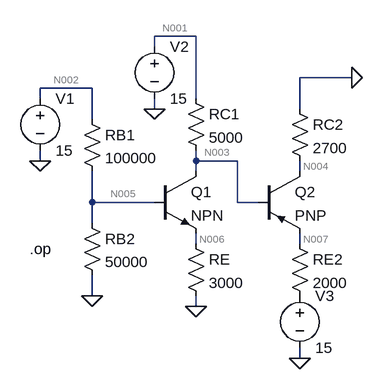
[diagram p0: schematic ECDL_ASSIGNMNEN4_APNANAAM.asc]
ECDL_ASSIGNMNEN4_APNANAAM.asc, the LTspice schematic file:
Version 4
SHEET 1 880 680
WIRE 192 -80 128 -80
WIRE 128 -64 128 -80
WIRE 432 -16 352 -16
WIRE 32 0 -48 0
WIRE -48 16 -48 0
WIRE 192 16 192 -80
WIRE 128 32 128 16
WIRE 352 32 352 -16
WIRE 32 48 32 0
WIRE -48 112 -48 96
WIRE 192 112 192 96
WIRE 256 112 192 112
WIRE 192 128 192 112
WIRE 352 128 352 112
WIRE 32 176 32 128
WIRE 128 176 32 176
WIRE 256 176 256 112
WIRE 288 176 256 176
WIRE 32 208 32 176
WIRE 192 240 192 224
WIRE 352 240 352 224
WIRE 32 320 32 288
WIRE 192 336 192 320
WIRE 352 416 352 400
FLAG 32 320 0
FLAG 192 336 0
FLAG 432 -16 0
FLAG -48 112 0
FLAG 128 32 0
FLAG 352 416 0
SYMBOL res 16 32 R0
SYMATTR InstName RB1
SYMATTR Value 100000
SYMBOL res 16 192 R0
SYMATTR InstName RB2
SYMATTR Value 50000
SYMBOL res 176 0 R0
SYMATTR InstName RC1
SYMATTR Value 5000
SYMBOL res 176 224 R0
SYMATTR InstName RE
SYMATTR Value 3000
SYMBOL res 336 224 R0
SYMATTR InstName RE2
SYMATTR Value 2000
SYMBOL npn 128 128 R0
SYMATTR InstName Q1
SYMBOL pnp 288 128 R0
SYMATTR InstName Q2
SYMBOL res 336 16 R0
SYMATTR InstName RC2
SYMATTR Value 2700
SYMBOL voltage -48 0 R0
SYMATTR InstName V1
SYMATTR Value 15
SYMBOL voltage 128 -80 R0
SYMATTR InstName V2
SYMATTR Value 15
SYMBOL voltage 352 304 R0
SYMATTR InstName V3
SYMATTR Value 15
TEXT -64 248 Left 2 !.op

The netlist it stands for:
* ECDL_ASSIGNMNEN4_APNANAAM.asc
RB1 N002 N005 100000
RB2 N005 0 50000
RC1 N001 N003 5000
RE N006 0 3000
RE2 N007 P001 2000
Q1 N003 N005 N006 0 NPN
Q2 N004 N003 N007 0 PNP
RC2 0 N004 2700
V1 N002 0 15
V2 N001 0 15
V3 P001 0 15
.model NPN NPN
.model PNP PNP
.lib standard.bjt
.op
.backanno
.end

* Results of the author's LTspice run, read from the files saved beside the schematic
* Operating Point:
*   V(n002) = 15 V
*   V(n005) = 4.582 V
*   V(n001) = 15 V
*   V(n003) = 8.859 V
*   V(n006) = 3.802 V
*   V(n007) = 9.658 V
*   V(p001) = 15 V
*   V(n004) = 7.14 V
*   Ic(Q2) = -2.644 mA
*   Ib(Q2) = -26.44 µA
*   Ie(Q2) = 2.671 mA
*   Ic(Q1) = 1.255 mA
*   Ib(Q1) = 12.55 µA
*   Ie(Q1) = -1.267 mA
*   I(Rc2) = -2.644 mA
*   I(Re2) = -2.671 mA
*   I(Re) = 1.267 mA
*   I(Rc1) = 1.228 mA
*   I(Rb2) = 91.64 µA
*   I(Rb1) = 104.2 µA
*   I(V3) = -2.671 mA
*   I(V2) = -1.228 mA
*   I(V1) = -104.2 µA
* From the log:
*   Semiconductor Device Operating Points:
*                           --- Bipolar Transistors ---
*   Name:       q2          q1
*   Model:      pnp         npn
*   Ib:      -2.64e-05    1.25e-05
*   Ic:      -2.64e-03    1.25e-03
*   Vbe:     -7.99e-01    7.80e-01
*   Vbc:      1.72e+00   -4.28e+00
*   Vce:     -2.52e+00    5.06e+00
*   BetaDC:   1.00e+02    1.00e+02
*   Gm:       1.02e-01    4.85e-02
*   Rpi:      9.78e+02    2.06e+03
*   Rx:       0.00e+00    0.00e+00
*   Ro:       1.88e+43    1.69e+86
*   Cbe:      0.00e+00    0.00e+00
*   Cbc:      0.00e+00    0.00e+00
*   Cjs:      0.00e+00    0.00e+00
*   BetaAC:   1.00e+02    1.00e+02
*   Cbx:      0.00e+00    0.00e+00
*   Ft:       0.00e+00    0.00e+00